# Altium schematic sheet cw312_xc7A35t_fpga_io1.SchDoc: I/O Pins
size Letter; Organization: NewAE Technology Inc.; Address1: 1083 Queen St., Suite 196; Address2: Halifax; Address3: NS; Address4: Canada B3H 0B2; SheetNumber: 4; SheetTotal: 4; SheetApproved: NO
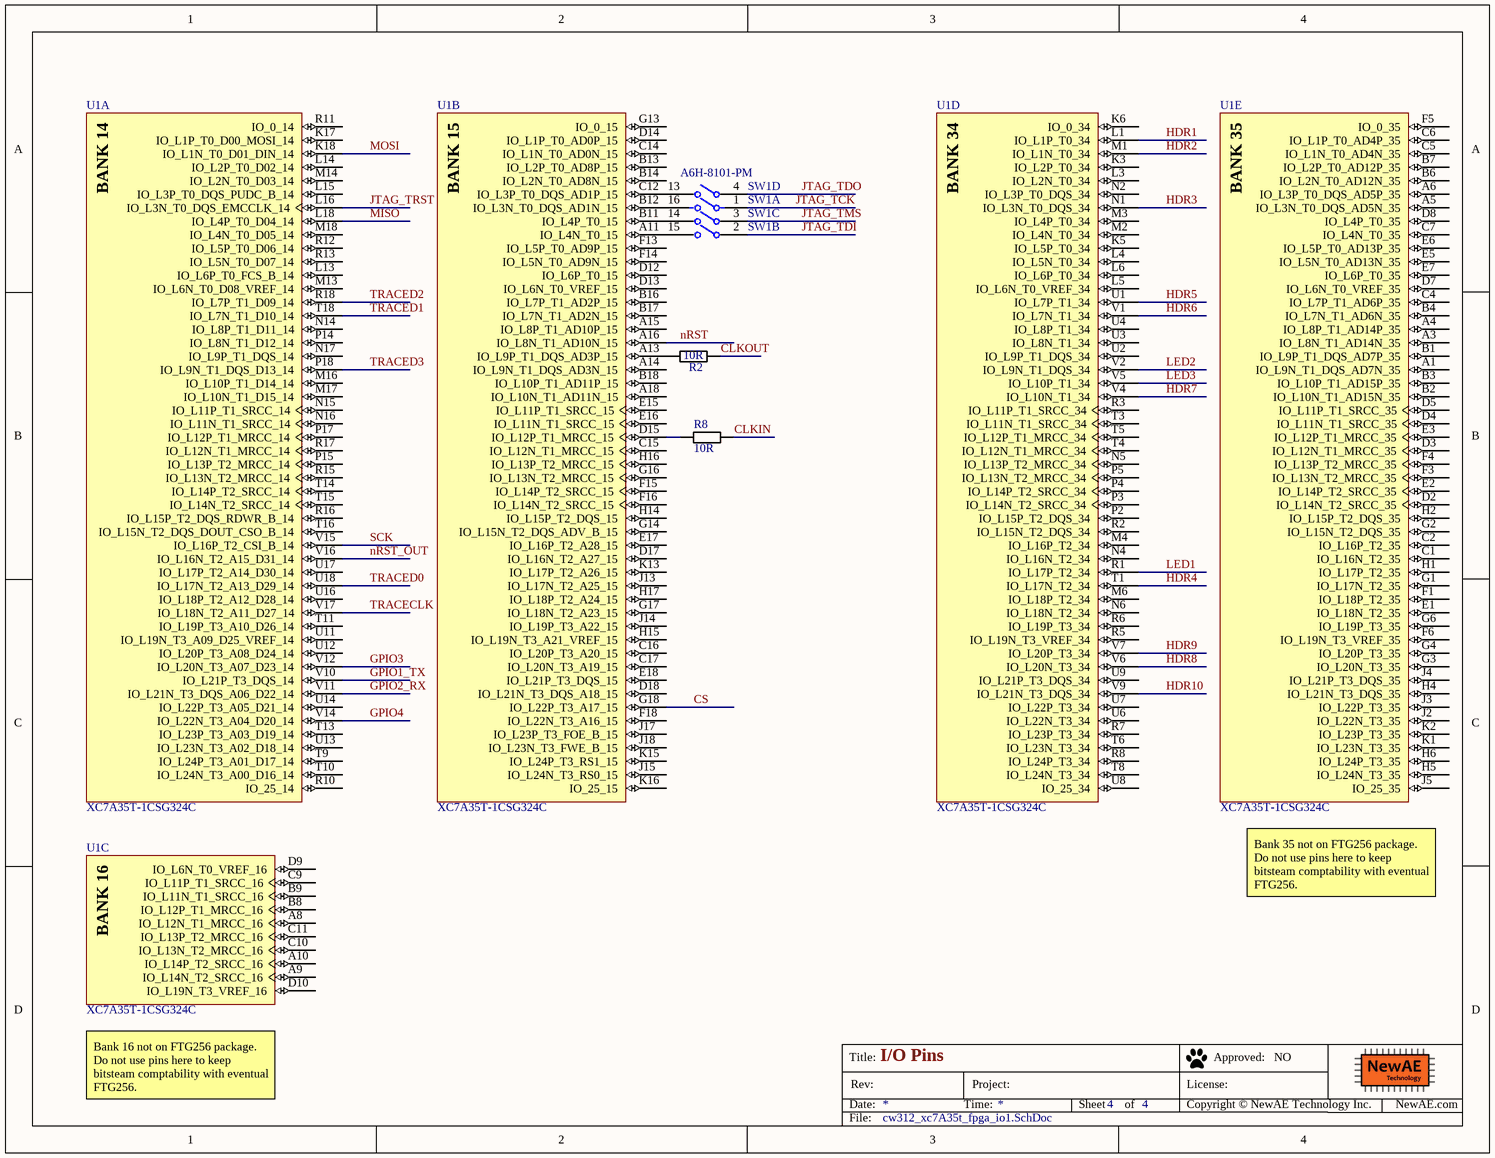
[diagram p0: cw312_xc7A35t_fpga_io1.SchDoc]

## Parts
R2  10R  [RESC1608X55N]
R8  10R  [RESC1608X55N]
SW1  A6H-8101-PM  [FP-A6H-8101-PM-MFG]  (parts A,B,C,D of 8)
U1  XC7A35T-1CSG324C  [CSG324]  (parts A,B,C,D,E of 9)

## Nets
CLKIN: R8.1
CLKOUT: R2.1
CS: U1.G18(IO_L22P_T3_A17_15)
GPIO1_TX: U1.V10(IO_L21P_T3_DQS_14)
GPIO2_RX: U1.V11(IO_L21N_T3_DQS_A06_D22_14)
GPIO3: U1.V12(IO_L20N_T3_A07_D23_14)
GPIO4: U1.V14(IO_L22N_T3_A04_D20_14)
HDR1: U1.L1(IO_L1P_T0_34)
HDR2: U1.M1(IO_L1N_T0_34)
HDR3: U1.N1(IO_L3N_T0_DQS_34)
HDR4: U1.T1(IO_L17N_T2_34)
HDR5: U1.U1(IO_L7P_T1_34)
HDR6: U1.V1(IO_L7N_T1_34)
HDR7: U1.V4(IO_L10N_T1_34)
HDR8: U1.V6(IO_L20N_T3_34)
HDR9: U1.V7(IO_L20P_T3_34)
HDR10: U1.V9(IO_L21N_T3_DQS_34)
JTAG_TCK: SW1.1
JTAG_TDI: SW1.2
JTAG_TDO: SW1.4
JTAG_TMS: SW1.3
JTAG_TRST: U1.L16(IO_L3N_T0_DQS_EMCCLK_14)
LED1: U1.R1(IO_L17P_T2_34)
LED2: U1.V2(IO_L9N_T1_DQS_34)
LED3: U1.V5(IO_L10P_T1_34)
MISO: U1.L18(IO_L4P_T0_D04_14)
MOSI: U1.K18(IO_L1N_T0_D01_DIN_14)
nRST: U1.A16(IO_L8N_T1_AD10N_15)
nRST_OUT: U1.V16(IO_L16N_T2_A15_D31_14)
SCK: U1.V15(IO_L16P_T2_CSI_B_14)
TRACECLK: U1.V17(IO_L18N_T2_A11_D27_14)
TRACED0: U1.U18(IO_L17N_T2_A13_D29_14)
TRACED1: U1.T18(IO_L7N_T1_D10_14)
TRACED2: U1.R18(IO_L7P_T1_D09_14)
TRACED3: U1.P18(IO_L9N_T1_DQS_D13_14)
NetR2_2: R2.2 U1.A13(IO_L9P_T1_DQS_AD3P_15)
NetR8_2: R8.2 U1.D15(IO_L12P_T1_MRCC_15)
NetSW1_13: SW1.13 U1.C12(IO_L3P_T0_DQS_AD1P_15)
NetSW1_14: SW1.14 U1.B11(IO_L4P_T0_15)
NetSW1_15: SW1.15 U1.A11(IO_L4N_T0_15)
NetSW1_16: SW1.16 U1.B12(IO_L3N_T0_DQS_AD1N_15)

Not connected (* = marked no-connect by the designer): U1 A1(IO_L9N_T1_DQS_AD7N_35) A3(IO_L8N_T1_AD14N_35) A4(IO_L8P_T1_AD14P_35) A5(IO_L3N_T0_DQS_AD5N_35) A6(IO_L3P_T0_DQS_AD5P_35) A8(IO_L12N_T1_MRCC_16) A9(IO_L14N_T2_SRCC_16) A10(IO_L14P_T2_SRCC_16) A14(IO_L9N_T1_DQS_AD3N_15) A15(IO_L8P_T1_AD10P_15) A18(IO_L10N_T1_AD11N_15) B1(IO_L9P_T1_DQS_AD7P_35) B2(IO_L10N_T1_AD15N_35) B3(IO_L10P_T1_AD15P_35) B4(IO_L7N_T1_AD6N_35) B6(IO_L2N_T0_AD12N_35) B7(IO_L2P_T0_AD12P_35) B8(IO_L12P_T1_MRCC_16) B9(IO_L11N_T1_SRCC_16) B13(IO_L2P_T0_AD8P_15) B14(IO_L2N_T0_AD8N_15) B16(IO_L7P_T1_AD2P_15) B17(IO_L7N_T1_AD2N_15) B18(IO_L10P_T1_AD11P_15) C1(IO_L16N_T2_35) C2(IO_L16P_T2_35) C4(IO_L7P_T1_AD6P_35) C5(IO_L1N_T0_AD4N_35) C6(IO_L1P_T0_AD4P_35) C7(IO_L4N_T0_35) C9(IO_L11P_T1_SRCC_16) C10(IO_L13N_T2_MRCC_16) C11(IO_L13P_T2_MRCC_16) C14(IO_L1N_T0_AD0N_15) C15(IO_L12N_T1_MRCC_15) C16(IO_L20P_T3_A20_15) C17(IO_L20N_T3_A19_15) D2(IO_L14N_T2_SRCC_35) D3(IO_L12N_T1_MRCC_35) D4(IO_L11N_T1_SRCC_35) D5(IO_L11P_T1_SRCC_35) D7(IO_L6N_T0_VREF_35) D8(IO_L4P_T0_35) D9(IO_L6N_T0_VREF_16) D10(IO_L19N_T3_VREF_16) D12(IO_L6P_T0_15) D13(IO_L6N_T0_VREF_15) D14(IO_L1P_T0_AD0P_15) D17(IO_L16N_T2_A27_15) D18(IO_L21N_T3_DQS_A18_15) E1(IO_L18N_T2_35) E2(IO_L14P_T2_SRCC_35) E3(IO_L12P_T1_MRCC_35) E5(IO_L5N_T0_AD13N_35) E6(IO_L5P_T0_AD13P_35) E7(IO_L6P_T0_35) E15(IO_L11P_T1_SRCC_15) E16(IO_L11N_T1_SRCC_15) E17(IO_L16P_T2_A28_15) E18(IO_L21P_T3_DQS_15) F1(IO_L18P_T2_35) F3(IO_L13N_T2_MRCC_35) F4(IO_L13P_T2_MRCC_35) F5(IO_0_35) F6(IO_L19N_T3_VREF_35) F13(IO_L5P_T0_AD9P_15) F14(IO_L5N_T0_AD9N_15) F15(IO_L14P_T2_SRCC_15) F16(IO_L14N_T2_SRCC_15) F18(IO_L22N_T3_A16_15) G1(IO_L17N_T2_35) G2(IO_L15N_T2_DQS_35) G3(IO_L20N_T3_35) G4(IO_L20P_T3_35) G6(IO_L19P_T3_35) G13(IO_0_15) G14(IO_L15N_T2_DQS_ADV_B_15) G16(IO_L13N_T2_MRCC_15) G17(IO_L18N_T2_A23_15) H1(IO_L17P_T2_35) H2(IO_L15P_T2_DQS_35) H4(IO_L21N_T3_DQS_35) H5(IO_L24N_T3_35) H6(IO_L24P_T3_35) H14(IO_L15P_T2_DQS_15) H15(IO_L19N_T3_A21_VREF_15) H16(IO_L13P_T2_MRCC_15) H17(IO_L18P_T2_A24_15) J2(IO_L22N_T3_35) J3(IO_L22P_T3_35) J4(IO_L21P_T3_DQS_35) J5(IO_25_35) J13(IO_L17N_T2_A25_15) J14(IO_L19P_T3_A22_15) J15(IO_L24N_T3_RS0_15) J17(IO_L23P_T3_FOE_B_15) J18(IO_L23N_T3_FWE_B_15) K1(IO_L23N_T3_35) K2(IO_L23P_T3_35) K3(IO_L2P_T0_34) K5(IO_L5P_T0_34) K6(IO_0_34) K13(IO_L17P_T2_A26_15) K15(IO_L24P_T3_RS1_15) K16(IO_25_15) K17(IO_L1P_T0_D00_MOSI_14) L3(IO_L2N_T0_34) L4(IO_L5N_T0_34) L5(IO_L6N_T0_VREF_34) L6(IO_L6P_T0_34) L13(IO_L6P_T0_FCS_B_14) L14(IO_L2P_T0_D02_14) L15(IO_L3P_T0_DQS_PUDC_B_14) M2(IO_L4N_T0_34) M3(IO_L4P_T0_34) M4(IO_L16P_T2_34) M6(IO_L18P_T2_34) M13(IO_L6N_T0_D08_VREF_14) M14(IO_L2N_T0_D03_14) M16(IO_L10P_T1_D14_14) M17(IO_L10N_T1_D15_14) M18(IO_L4N_T0_D05_14) N2(IO_L3P_T0_DQS_34) N4(IO_L16N_T2_34) N5(IO_L13P_T2_MRCC_34) N6(IO_L18N_T2_34) N14(IO_L8P_T1_D11_14) N15(IO_L11P_T1_SRCC_14) N16(IO_L11N_T1_SRCC_14) N17(IO_L9P_T1_DQS_14) P2(IO_L15P_T2_DQS_34) P3(IO_L14N_T2_SRCC_34) P4(IO_L14P_T2_SRCC_34) P5(IO_L13N_T2_MRCC_34) P14(IO_L8N_T1_D12_14) P15(IO_L13P_T2_MRCC_14) P17(IO_L12P_T1_MRCC_14) R2(IO_L15N_T2_DQS_34) R3(IO_L11P_T1_SRCC_34) R5(IO_L19N_T3_VREF_34) R6(IO_L19P_T3_34) R7(IO_L23P_T3_34) R8(IO_L24P_T3_34) R10(IO_25_14) R11(IO_0_14) R12(IO_L5P_T0_D06_14) R13(IO_L5N_T0_D07_14) R15(IO_L13N_T2_MRCC_14) R16(IO_L15P_T2_DQS_RDWR_B_14) R17(IO_L12N_T1_MRCC_14) T3(IO_L11N_T1_SRCC_34) T4(IO_L12N_T1_MRCC_34) T5(IO_L12P_T1_MRCC_34) T6(IO_L23N_T3_34) T8(IO_L24N_T3_34) T9(IO_L24P_T3_A01_D17_14) T10(IO_L24N_T3_A00_D16_14) T11(IO_L19P_T3_A10_D26_14) T13(IO_L23P_T3_A03_D19_14) T14(IO_L14P_T2_SRCC_14) T15(IO_L14N_T2_SRCC_14) T16(IO_L15N_T2_DQS_DOUT_CSO_B_14) U2(IO_L9P_T1_DQS_34) U3(IO_L8N_T1_34) U4(IO_L8P_T1_34) U6(IO_L22N_T3_34) U7(IO_L22P_T3_34) U8(IO_25_34) U9(IO_L21P_T3_DQS_34) U11(IO_L19N_T3_A09_D25_VREF_14) U12(IO_L20P_T3_A08_D24_14) U13(IO_L23N_T3_A02_D18_14) U14(IO_L22P_T3_A05_D21_14) U16(IO_L18P_T2_A12_D28_14) U17(IO_L17P_T2_A14_D30_14)

## Notes on the sheet
- (near U1) Bank 35 not on FTG256 package. Do not use pins here to keep bitsteam comptability with eventual FTG256.
- (near U1) Bank 16 not on FTG256 package. Do not use pins here to keep bitsteam comptability with eventual FTG256.
- Title:
- Date:
- Rev:
- Time:
- Project:
- Sheet
- of
- License:
- Copyright © NewAE Technology Inc.
- Approved:
- NewAE.com
- File:
- (in symbol CMP-0383-00012-1, part A) BANK 14
- (in symbol CMP-0383-00012-1, part B) BANK 15
- (in symbol CMP-0383-00012-1, part C) BANK 16
- (in symbol CMP-0383-00012-1, part D) BANK 34
- (in symbol CMP-0383-00012-1, part E) BANK 35

## Library data of the parts
R2 R8 = RCHIP-10R-0603: 10R res, 0603, 1%, 1/10W; Manufacture 1: Yageo; Manufacture Part Number 1: RC0603FR-0710RL; Component Group: Resistor; Case-EIA: 0603; Case-Metric: 1608; Rated Power: 0.1W; Rated Voltage: 75VDC; Part Number: RCHIP-10R-0603; Footprint: 0603; Pin Count: 2; Supplier 1: Digi-Key; Supplier Part Number 1: 311-10.0HRCT-ND; Value: 10R; Tolerance: 1%; Mounting Technology: SMT; Temperature Range: -55C to 155C; Component Kind: Standard; Component Type: Standard
SW1 = CMP-08827-000045-1: SWITCH SLIDE DIP SPST 25MA 24V; Number of Positions: 8; Actuator Type: Slide (Standard); Mechanical Life: 1000Cycles; Pitch: 0.05inch; Washable: No; Radiation Hardening: No; Max Operating Temperature: 70°C; Packaging: Tape and Reel; Max Current Rating: 25mA; Mount: Surface Mount; Voltage Rating (DC): 24V; Package Quantity: 4000; Length: 0.448inch; Depth: 6.7mm; Orientation: Straight; Throw Configuration: SPST; Termination: Gull Wing; Max Voltage Rating (DC): 24V; Series: A6H; Min Operating Temperature: -20°C; Current Rating: 25mA; Electrical Life: 1000Cycles
U1 = CMP-0383-00012-1: Artix-7 FPGA, 210 User I/Os, 0 GTP, 324-Ball BGA, Speed Grade 1, Commercial Grade, Pb-Free; Manufacturer: Xilinx; GTP: 0; Available User I/O: 210; Speed Grades: 1; Logic Cells: 33280; Total Block RAM: 1800 Kb; CMTs: 5; Maximum Distributed RAM: 400 Kb; ComponentLink2URL: http://www.xilinx.com/support/documentation/data_sheets/ds180_7Series_Overview.pdf; ComponentLink2Description: Datasheet; DatasheetVersion: Rev. 1.15; PackageDescription: 324-Ball Wire-Bond Chip-Scale BGA, Body 15 x 15 mm, Pitch 0.8 mm; ComponentLink4URL: http://www.xilinx.com/support/documentation/user_guides/ug475_7Series_Pkg_Pinout.pdf; PackageReference: CSG-324; Mounting Technology: Surface Mount; PackageVersion: Rev. 1.11; ComponentLink1Description: Manufacturer URL; ComponentLink3Description: Pinout; ComponentLink1URL: http://www.xilinx.com/; ComponentLink3URL: http://www.xilinx.com/support/documentation/user_guides/ug475_7Series_Pkg_Pinout.pdf; PartNumber: XC7A35T-1CSG324C; ComponentLink4Description: Package Specification; Operating Temperature Range: Commercial